# Altium schematic sheet mix_main.SchDoc: mcHF Pro Transceiver UI board
size A3; Author: Krassi Atanassov; CompanyName: MØNKA; Engineer: For radio amateurs experimentation, non-commercial use only. Thank you!; Revision: 0.9.0; SheetTotal: 7
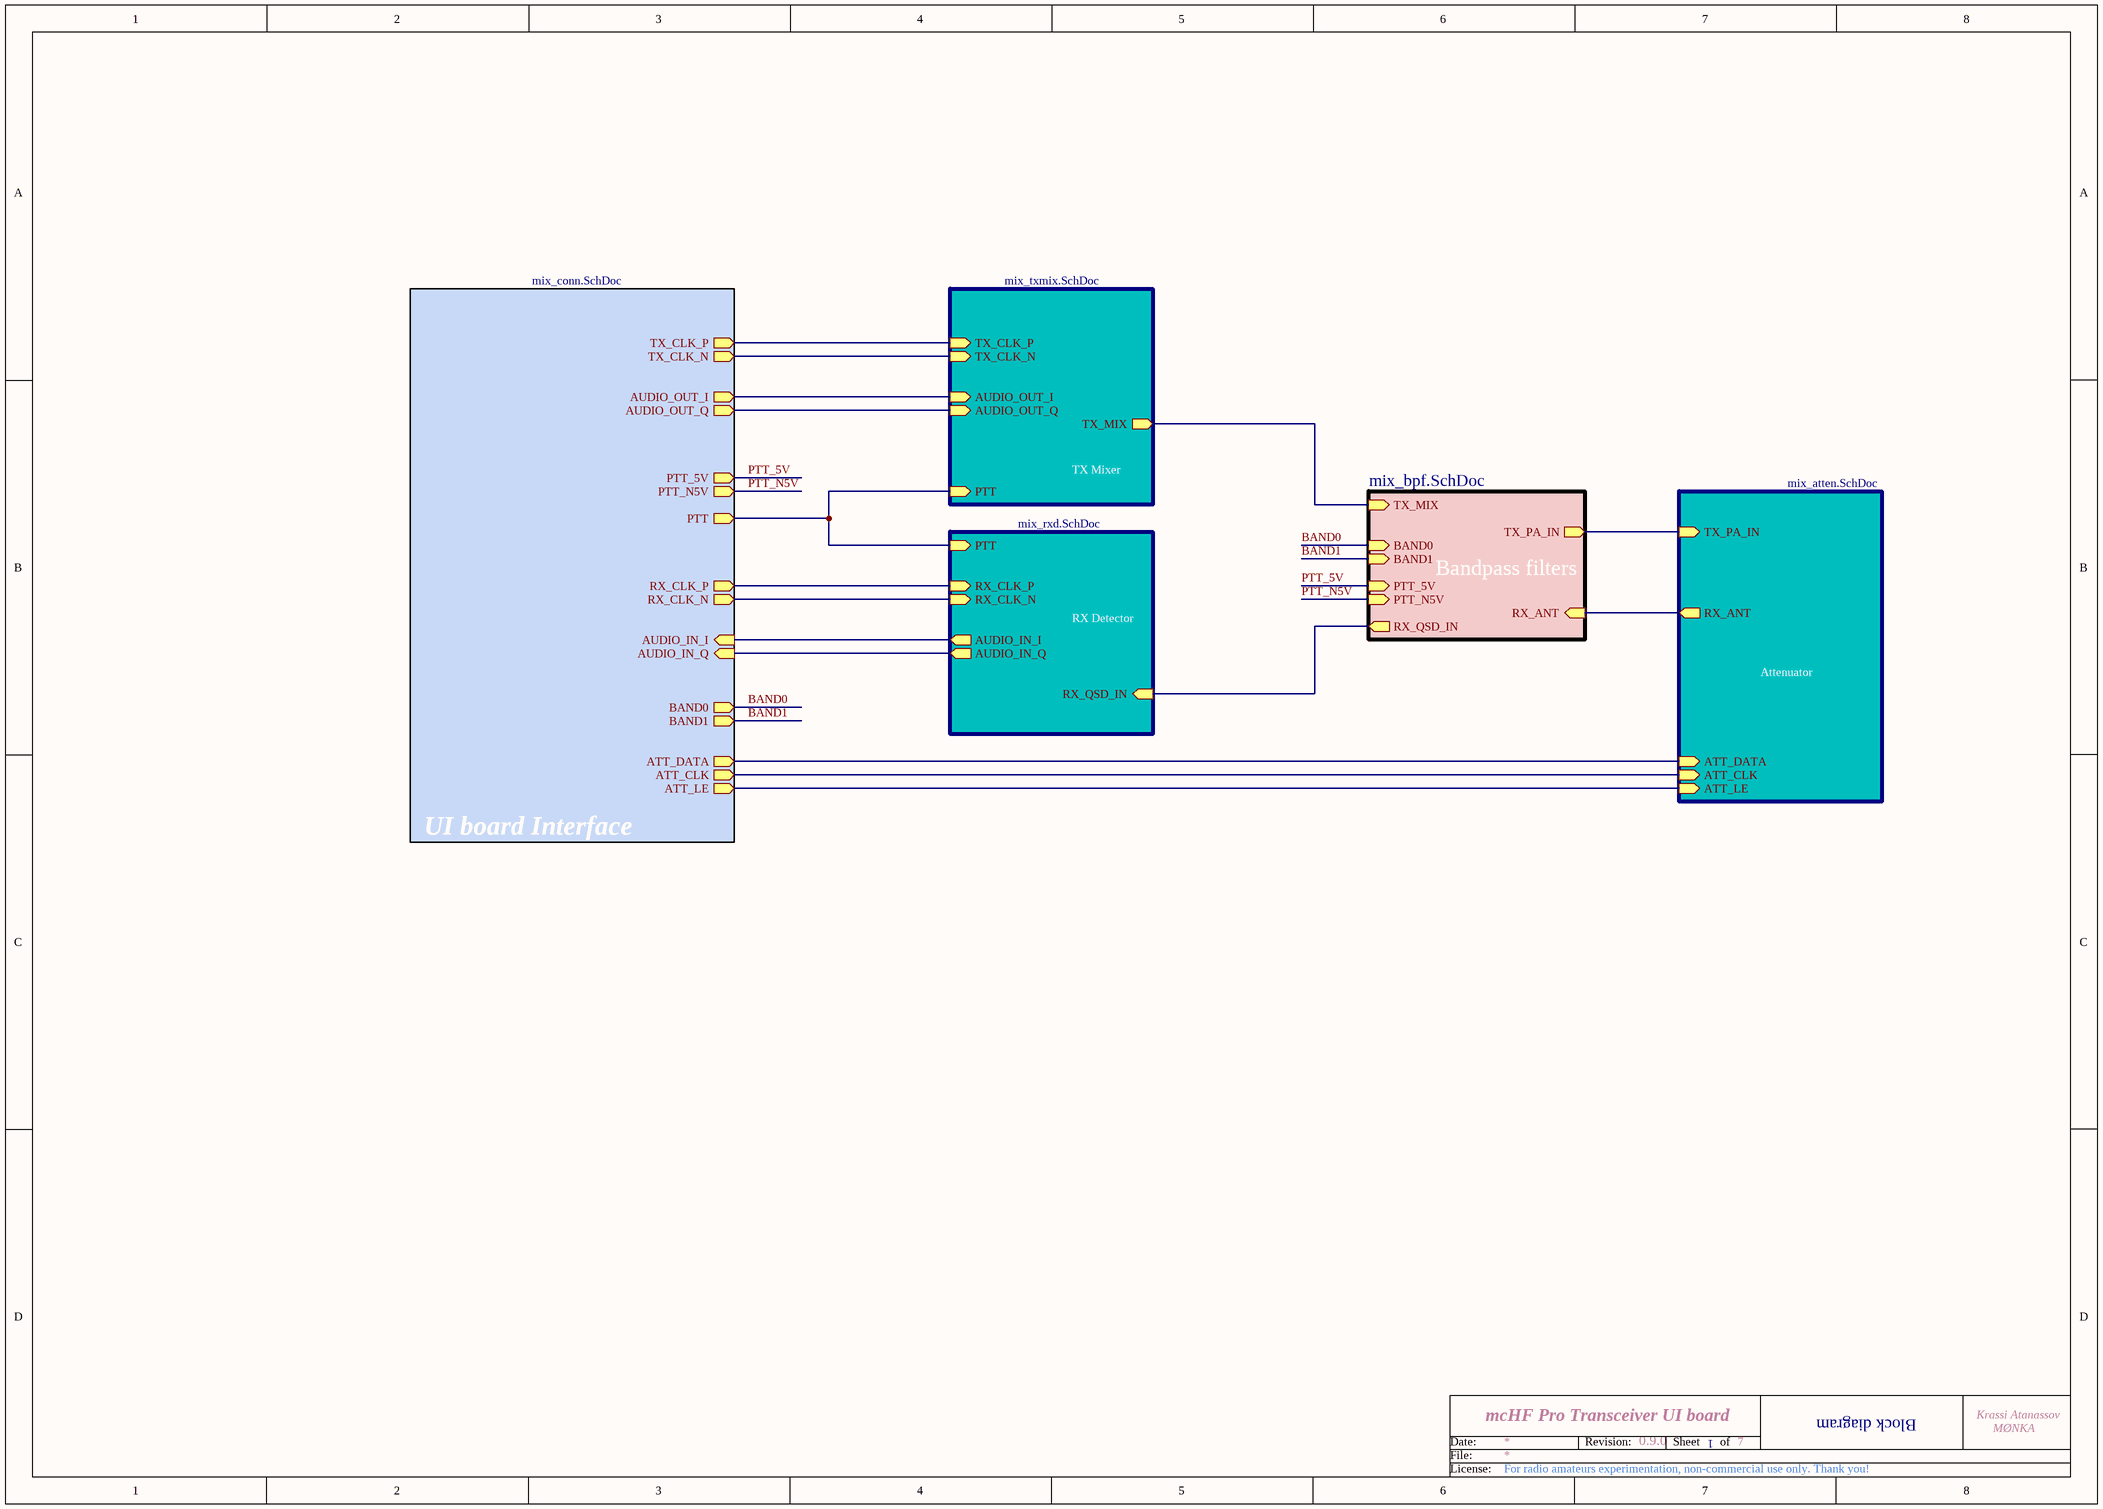
[diagram p0: mix_main.SchDoc]

## Sub-sheets
Attenuator = mix_atten.SchDoc: RX_ANT (out), ATT_DATA (in), ATT_CLK (in), ATT_LE (in), TX_PA_IN (in)
Bandpass filters = mix_bpf.SchDoc: BAND0 (in), BAND1 (in), PTT_5V (in), RX_ANT (in), TX_PA_IN (out), PTT_N5V (in), RX_QSD_IN (out), TX_MIX (in)
RX Detector = mix_rxd.SchDoc: RX_QSD_IN (in), AUDIO_IN_I (out), AUDIO_IN_Q (out), PTT (in), RX_CLK_N (in), RX_CLK_P (in)
TX Mixer = mix_txmix.SchDoc: TX_MIX (out), TX_CLK_P (in), TX_CLK_N (in), AUDIO_OUT_I (in), AUDIO_OUT_Q (in), PTT (in)
UI board Interface = mix_conn.SchDoc: AUDIO_OUT_Q (out), AUDIO_IN_I (in), AUDIO_OUT_I (out), AUDIO_IN_Q (in), RX_CLK_N (out), RX_CLK_P (out), TX_CLK_P (out), TX_CLK_N (out), PTT (out), ATT_DATA (out), ATT_CLK (out), ATT_LE (out), PTT_5V (out), PTT_N5V (out), BAND0 (out), BAND1 (out)

## Nets
BAND0: sheet UI board Interface/BAND0, sheet Bandpass filters/BAND0
BAND1: sheet UI board Interface/BAND1, sheet Bandpass filters/BAND1
PTT_5V: sheet UI board Interface/PTT_5V, sheet Bandpass filters/PTT_5V
PTT_N5V: sheet UI board Interface/PTT_N5V, sheet Bandpass filters/PTT_N5V
(unnamed): sheet UI board Interface/AUDIO_OUT_Q, sheet TX Mixer/AUDIO_OUT_Q
(unnamed): sheet UI board Interface/AUDIO_IN_I, sheet RX Detector/AUDIO_IN_I
(unnamed): sheet UI board Interface/AUDIO_OUT_I, sheet TX Mixer/AUDIO_OUT_I
(unnamed): sheet UI board Interface/AUDIO_IN_Q, sheet RX Detector/AUDIO_IN_Q
(unnamed): sheet UI board Interface/RX_CLK_N, sheet RX Detector/RX_CLK_N
(unnamed): sheet UI board Interface/RX_CLK_P, sheet RX Detector/RX_CLK_P
(unnamed): sheet UI board Interface/TX_CLK_P, sheet TX Mixer/TX_CLK_P
(unnamed): sheet UI board Interface/TX_CLK_N, sheet TX Mixer/TX_CLK_N
(unnamed): sheet UI board Interface/PTT, sheet TX Mixer/PTT, sheet RX Detector/PTT
(unnamed): sheet UI board Interface/ATT_DATA, sheet Attenuator/ATT_DATA
(unnamed): sheet UI board Interface/ATT_CLK, sheet Attenuator/ATT_CLK
(unnamed): sheet UI board Interface/ATT_LE, sheet Attenuator/ATT_LE
(unnamed): sheet TX Mixer/TX_MIX, sheet Bandpass filters/TX_MIX
(unnamed): sheet RX Detector/RX_QSD_IN, sheet Bandpass filters/RX_QSD_IN
(unnamed): sheet Bandpass filters/RX_ANT, sheet Attenuator/RX_ANT
(unnamed): sheet Bandpass filters/TX_PA_IN, sheet Attenuator/TX_PA_IN

## Notes on the sheet
- 1
- Block diagram
- Date:
- File:
- Revision:
- Sheet
- of
- License: